# EAGLE design hand_pcb (EAGLE 7.5.0)
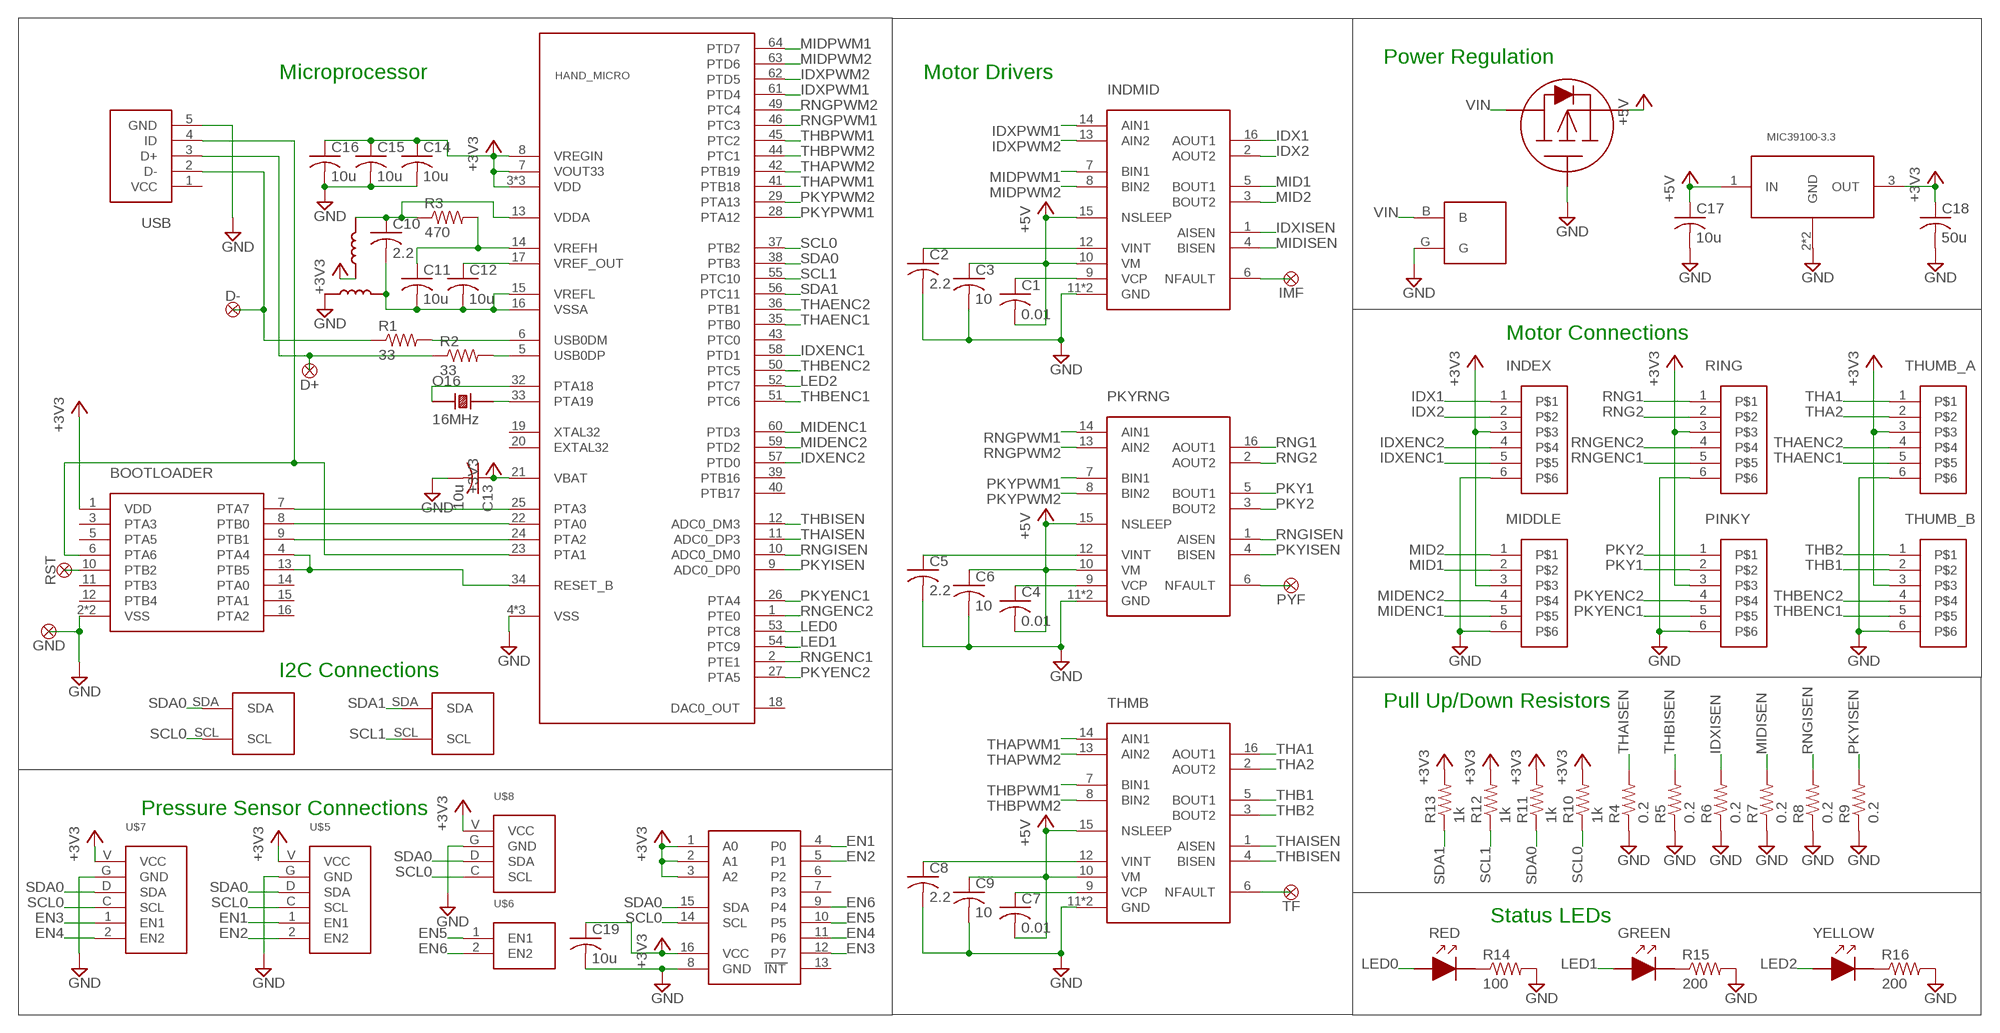
[diagram p0: schematic, sheet 1]

## Parts
BOOTLOADER  MKL02Z32CORRECT  [QFN16]
C1  0.01  C-USC0603  [C0603]
C2  2.2  C-USC0603  [C0603]
C3  10  C-USC0603  [C0603]
C4  0.01  C-USC0603  [C0603]
C5  2.2  C-USC0603  [C0603]
C6  10  C-USC0603  [C0603]
C7  0.01  C-USC0603  [C0603]
C8  2.2  C-USC0603  [C0603]
C9  10  C-USC0603  [C0603]
C10  2.2  C-USC0402  [C0402]
C11  10u  C-USC0402  [C0402]
C12  10u  C-USC0402  [C0402]
C13  10u  C-USC0402  [C0402]
C14  10u  C-USC0402  [C0402]
C15  10u  C-USC0402  [C0402]
C16  10u  C-USC0402  [C0402]
C17  10u  C-USC0603  [C0603]
C18  50u  C-USC0603  [C0603]
C19  10u  C-USC0402  [C0402]
D+  TESTPAD  [TESTPAD]
D-  TESTPAD  [TESTPAD]
GND  TESTPAD  [TESTPAD]
GREEN  LED0603  [L0603]
HAND_MICRO  MK20DX256VLH7  [LQFP-64-10-10]
IMF  TESTPAD  [TESTPAD]
INDEX  DF57H-6PTOP  [DF57H-6P-TOP]
INDMID  DRV8833  [WQFN-16]
MIDDLE  DF57H-6PTOP  [DF57H-6P-TOP]
O16  16MHz  NX3225SA  [NX3225SA]
PINKY  DF57H-6PTOP  [DF57H-6P-TOP]
PKYRNG  DRV8833  [WQFN-16]
PYF  TESTPAD  [TESTPAD]
R1  33  R-US_R0402  [R0402]
R2  33  R-US_R0402  [R0402]
R3  470  R-US_R0402  [R0402]
R4  0.2  R-US_R1206  [R1206]
R5  0.2  R-US_R1206  [R1206]
R6  0.2  R-US_R1206  [R1206]
R7  0.2  R-US_R1206  [R1206]
R8  0.2  R-US_R1206  [R1206]
R9  0.2  R-US_R1206  [R1206]
R10  1k  R-US_R0603  [R0603]
R11  1k  R-US_R0603  [R0603]
R12  1k  R-US_R0603  [R0603]
R13  1k  R-US_R0603  [R0603]
R14  100  R-US_R0603  [R0603]
R15  200  R-US_R0603  [R0603]
R16  200  R-US_R0603  [R0603]
RED  LED0603  [L0603]
RING  DF57H-6PTOP  [DF57H-6P-TOP]
RST  TESTPAD  [TESTPAD]
TF  TESTPAD  [TESTPAD]
THMB  DRV8833  [WQFN-16]
THUMB_A  DF57H-6PTOP  [DF57H-6P-TOP]
THUMB_B  DF57H-6PTOP  [DF57H-6P-TOP]
U$1  TCA9534TSSOP  [TSSOP16]
U$2  SPD15P10PLG  [PG-TO-252-3]
U$3  FERRITE600OHM100MHZ  [L0603]
U$4  FERRITE600OHM100MHZ  [L0603]
U$5  PSENSE  [PSENSE]
U$6  PSENSE2  [PSENSE2]
U$7  PSENSE  [PSENSE]
U$8  PSENSE4  [PSENSE4]
U$9  MIC391003.3  [MIC39100]
U$10  THRUHOLE2  [THRUHOLE2]
U$11  THRUHOLEI2C  [THRUHOLEI2C]
U$12  THRUHOLEI2C  [THRUHOLEI2C]
USB  10118194-0001LF  [10118194-0001LF]
YELLOW  LED0603  [L0603]

## Nets
+3V3: BOOTLOADER.1(VDD) C13.1 C14.1 C15.1 C16.1 C18.1 C19.1 HAND_MICRO.3(VDD) HAND_MICRO.7(VOUT33) HAND_MICRO.8(VREGIN) HAND_MICRO.21(VBAT) HAND_MICRO.30(VDD) HAND_MICRO.48(VDD) INDEX.3 MIDDLE.3 PINKY.3 R10.2 R11.2 R12.2 R13.2 RING.3 THUMB_A.3 THUMB_B.3 U$1.1(A0) U$1.2(A1) U$1.3(A2) U$1.16(VCC) U$4.1 U$5.V(VCC) U$7.V(VCC) U$8.V(VCC) U$9.3(OUT)
+5V: C1.2 C3.1 C4.2 C6.1 C7.2 C9.1 C17.1 INDMID.10(VM) INDMID.15(NSLEEP) PKYRNG.10(VM) PKYRNG.15(NSLEEP) THMB.10(VM) THMB.15(NSLEEP) U$2.3 U$9.1(IN)
EN1: U$1.4(P0) U$5.1(EN1)
EN2: U$1.5(P1) U$5.2(EN2)
EN3: U$1.12(P7) U$7.1(EN1)
EN4: U$1.11(P6) U$7.2(EN2)
EN5: U$1.10(P5) U$6.1(EN1)
EN6: U$1.9(P4) U$6.2(EN2)
GND: BOOTLOADER.2(VSS) BOOTLOADER.TH(VSS) C2.2 C3.2 C5.2 C6.2 C8.2 C9.2 C13.2 C14.2 C15.2 C16.2 C17.2 C18.2 C19.2 GND.P$1 HAND_MICRO.4(VSS) HAND_MICRO.31(VSS) HAND_MICRO.47(VSS) INDEX.6 INDMID.11(GND) INDMID.PPAD(GND) MIDDLE.6 PINKY.6 PKYRNG.11(GND) PKYRNG.PPAD(GND) R4.1 R5.1 R6.1 R7.1 R8.1 R9.1 R14.2 R15.2 R16.2 RING.6 THMB.11(GND) THMB.PPAD(GND) THUMB_A.6 THUMB_B.6 U$1.8(GND) U$2.1 U$3.1 U$5.G(GND) U$7.G(GND) U$8.G(GND) U$9.2(GND) U$9.TAB(GND) U$10.G USB.5(GND)
IDX1: INDEX.1 INDMID.16(AOUT1)
IDX2: INDEX.2 INDMID.2(AOUT2)
IDXENC1: HAND_MICRO.58(PTD1) INDEX.5
IDXENC2: HAND_MICRO.57(PTD0) INDEX.4
IDXISEN: INDMID.1(AISEN) R6.2
IDXPWM1: HAND_MICRO.61(PTD4) INDMID.14(AIN1)
IDXPWM2: HAND_MICRO.62(PTD5) INDMID.13(AIN2)
LED0: HAND_MICRO.53(PTC8) RED.1
LED1: GREEN.1 HAND_MICRO.54(PTC9)
LED2: HAND_MICRO.52(PTC7) YELLOW.1
MID1: INDMID.5(BOUT1) MIDDLE.2
MID2: INDMID.3(BOUT2) MIDDLE.1
MIDENC1: HAND_MICRO.60(PTD3) MIDDLE.5
MIDENC2: HAND_MICRO.59(PTD2) MIDDLE.4
MIDISEN: INDMID.4(BISEN) R7.2
MIDPWM1: HAND_MICRO.64(PTD7) INDMID.7(BIN1)
MIDPWM2: HAND_MICRO.63(PTD6) INDMID.8(BIN2)
N$1: R14.1 RED.2
N$2: GREEN.2 R15.1
N$3: R16.1 YELLOW.2
N$4: IMF.P$1 INDMID.6(NFAULT)
N$5: PKYRNG.6(NFAULT) PYF.P$1
N$6: TF.P$1 THMB.6(NFAULT)
N$7: C10.1 HAND_MICRO.13(VDDA) R3.1 U$4.2
N$8: BOOTLOADER.9(PTB1) HAND_MICRO.24(PTA2)
N$9: C11.1 HAND_MICRO.14(VREFH) R3.2
N$10: BOOTLOADER.8(PTB0) HAND_MICRO.22(PTA0)
N$11: BOOTLOADER.7(PTA7) HAND_MICRO.25(PTA3)
N$12: BOOTLOADER.10(PTB2) RST.P$1
N$17: BOOTLOADER.4(PTA4) BOOTLOADER.13(PTB5) HAND_MICRO.34(RESET_B)
N$18: C10.2 C11.2 C12.2 HAND_MICRO.15(VREFL) HAND_MICRO.16(VSSA) U$3.2
N$21: C1.1 INDMID.9(VCP)
N$22: C4.1 PKYRNG.9(VCP)
N$23: C7.1 THMB.9(VCP)
N$24: HAND_MICRO.33(PTA19) O16.3
N$25: C8.1 THMB.12(VINT)
N$26: C5.1 PKYRNG.12(VINT)
N$27: C2.1 INDMID.12(VINT)
N$28: HAND_MICRO.32(PTA18) O16.1
N$34: C12.1 HAND_MICRO.17(VREF_OUT)
N$35: BOOTLOADER.6(PTA6) HAND_MICRO.23(PTA1) USB.4(ID)
PKY1: PINKY.2 PKYRNG.5(BOUT1)
PKY2: PINKY.1 PKYRNG.3(BOUT2)
PKYENC1: HAND_MICRO.26(PTA4) PINKY.5
PKYENC2: HAND_MICRO.27(PTA5) PINKY.4
PKYISEN: HAND_MICRO.9(ADC0_DP0) PKYRNG.4(BISEN) R9.2
PKYPWM1: HAND_MICRO.28(PTA12) PKYRNG.7(BIN1)
PKYPWM2: HAND_MICRO.29(PTA13) PKYRNG.8(BIN2)
RNG1: PKYRNG.16(AOUT1) RING.1
RNG2: PKYRNG.2(AOUT2) RING.2
RNGENC1: HAND_MICRO.2(PTE1) RING.5
RNGENC2: HAND_MICRO.1(PTE0) RING.4
RNGISEN: HAND_MICRO.10(ADC0_DM0) PKYRNG.1(AISEN) R8.2
RNGPWM1: HAND_MICRO.46(PTC3) PKYRNG.14(AIN1)
RNGPWM2: HAND_MICRO.49(PTC4) PKYRNG.13(AIN2)
SCL0: HAND_MICRO.37(PTB2) R10.1 U$1.14(SCL) U$5.C(SCL) U$7.C(SCL) U$8.C(SCL) U$11.SCL
SCL1: HAND_MICRO.55(PTC10) R12.1 U$12.SCL
SDA0: HAND_MICRO.38(PTB3) R11.1 U$1.15(SDA) U$5.D(SDA) U$7.D(SDA) U$8.D(SDA) U$11.SDA
SDA1: HAND_MICRO.56(PTC11) R13.1 U$12.SDA
THA1: THMB.16(AOUT1) THUMB_A.1
THA2: THMB.2(AOUT2) THUMB_A.2
THAENC1: HAND_MICRO.35(PTB0) THUMB_A.5
THAENC2: HAND_MICRO.36(PTB1) THUMB_A.4
THAISEN: HAND_MICRO.11(ADC0_DP3) R4.2 THMB.1(AISEN)
THAPWM1: HAND_MICRO.41(PTB18) THMB.14(AIN1)
THAPWM2: HAND_MICRO.42(PTB19) THMB.13(AIN2)
THB1: THMB.5(BOUT1) THUMB_B.2
THB2: THMB.3(BOUT2) THUMB_B.1
THBENC1: HAND_MICRO.51(PTC6) THUMB_B.5
THBENC2: HAND_MICRO.50(PTC5) THUMB_B.4
THBISEN: HAND_MICRO.12(ADC0_DM3) R5.2 THMB.4(BISEN)
THBPWM1: HAND_MICRO.45(PTC2) THMB.7(BIN1)
THBPWM2: HAND_MICRO.44(PTC1) THMB.8(BIN2)
USB_D1_N [USB]: D-.P$1 R1.1 USB.2(D-)
USB_D1_P [USB]: D+.P$1 R2.1 USB.3(D+)
USB_D2_N [USB]: HAND_MICRO.6(USB0DM) R1.2
USB_D2_P [USB]: HAND_MICRO.5(USB0DP) R2.2
VIN: U$2.2 U$10.B
Unconnected: BOOTLOADER.3(PTA3) BOOTLOADER.5(PTA5) BOOTLOADER.11(PTB3) BOOTLOADER.12(PTB4) BOOTLOADER.14(PTA0) BOOTLOADER.15(PTA1) BOOTLOADER.16(PTA2) HAND_MICRO.18(DAC0_OUT) HAND_MICRO.19(XTAL32) HAND_MICRO.20(EXTAL32) HAND_MICRO.39(PTB16) HAND_MICRO.40(PTB17) HAND_MICRO.43(PTC0) U$1.6(P2) U$1.7(P3) U$1.13(INT) USB.1(VCC)

## Notes on the sheet
- Power Regulation
- Microprocessor | Motor Drivers
- Motor Connections
- I2C Connections
- Pull Up/Down Resistors
- Pressure Sensor Connections
- Status LEDs

## Library data of the parts
BOOTLOADER = 445-eagle-lib:MKL02Z32
C1-C19 = rcl:C-US: CAPACITOR, American symbol
D+ D- GND IMF PYF RST TF = 445-eagle-lib:TESTPAD
GREEN RED YELLOW = 445-eagle-lib:LED0603
HAND_MICRO = 445-eagle-lib:MK20DX256VLH7
INDEX MIDDLE PINKY RING THUMB_A THUMB_B = 445-eagle-lib:DF57H-6P
INDMID PKYRNG THMB = 445-eagle-lib:DRV8833
O16 = 445-eagle-lib:NX3225SA
R1-R16 = rcl:R-US_: RESISTOR, American symbol
U$1 = 445-eagle-lib:TCA9534: 8 Bit IO Expander
U$2 = 445-eagle-lib:SPD15P10PLG
U$3 U$4 = 445-eagle-lib:FERRITE600OHM100MHZ
U$5 U$7 = 445-eagle-lib:PSENSE
U$6 = 445-eagle-lib:PSENSE2
U$8 = 445-eagle-lib:PSENSE4
U$9 = 445-eagle-lib:MIC391003.3
U$10 = 445-eagle-lib:THRUHOLE2
U$11 U$12 = 445-eagle-lib:THRUHOLEI2C
USB = 445-eagle-lib:10118194-0001LF

## Net classes
1 USB: width 0.333 mm, drill 0.333 mm, clearance 0.178 mm
2 VCC_Pour: clearance 0.762 mm to class 1
3 GND_Pour: clearance 0.762 mm to class 1

## Board
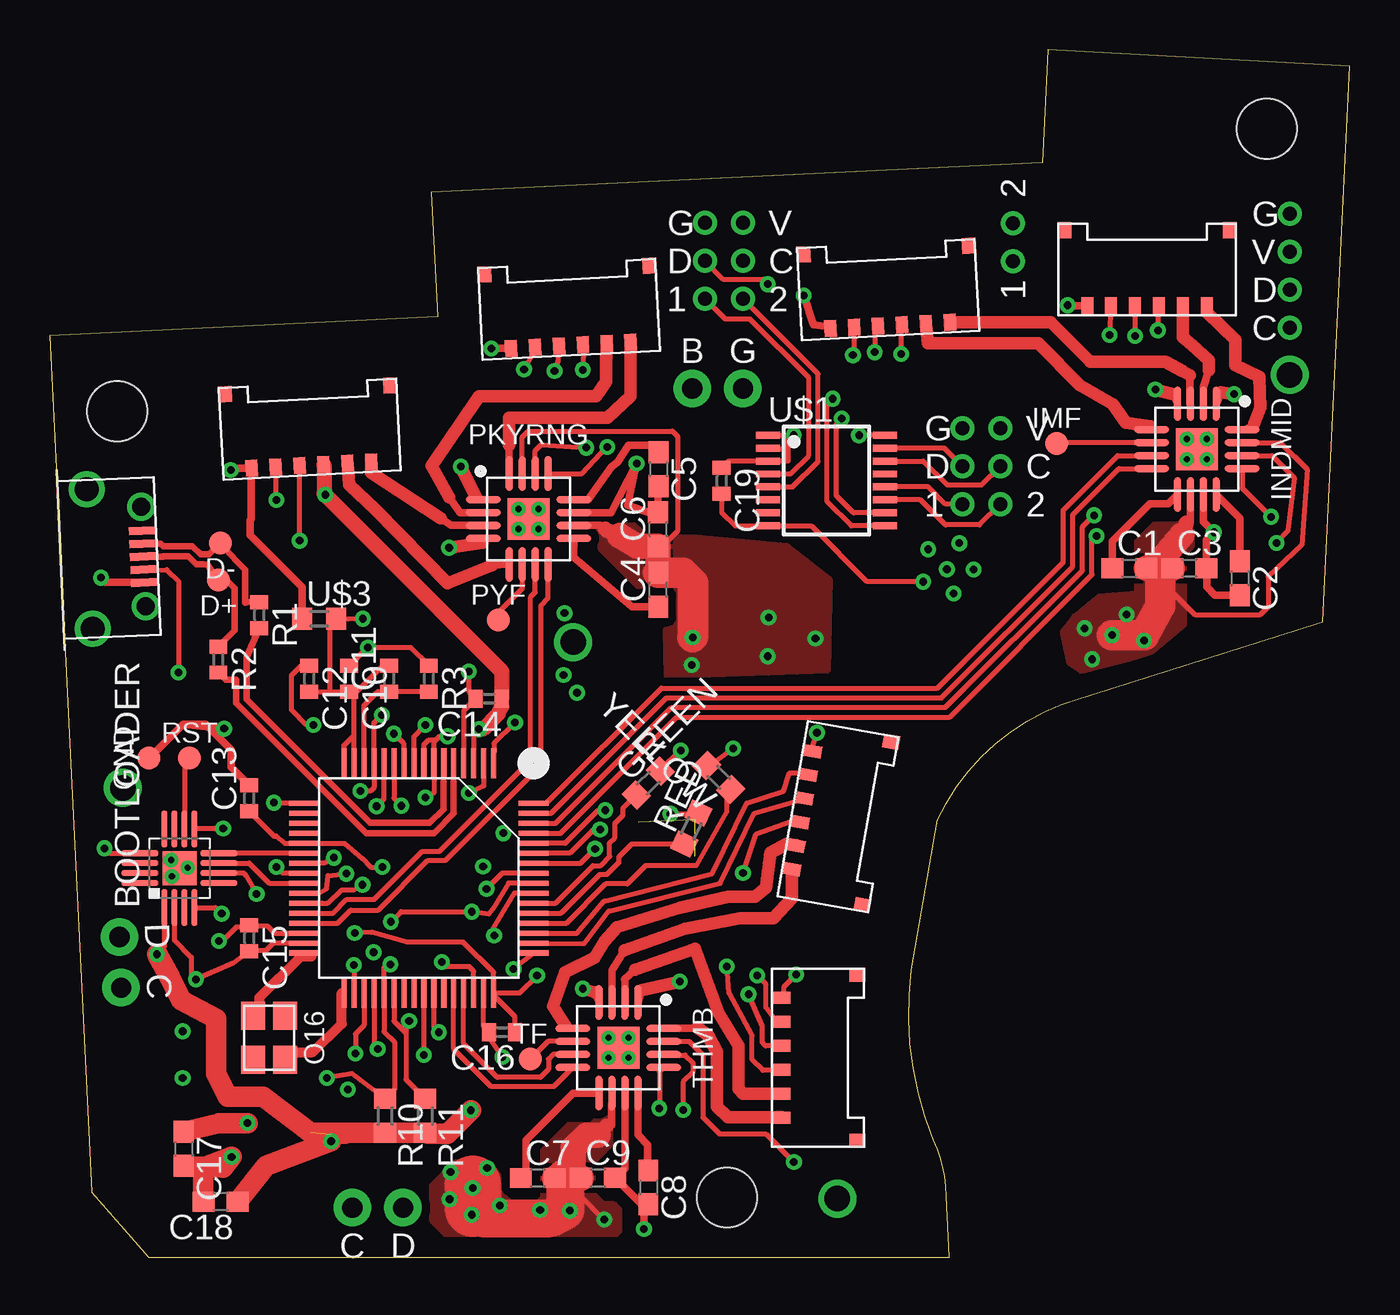
[diagram p1: board, top side]
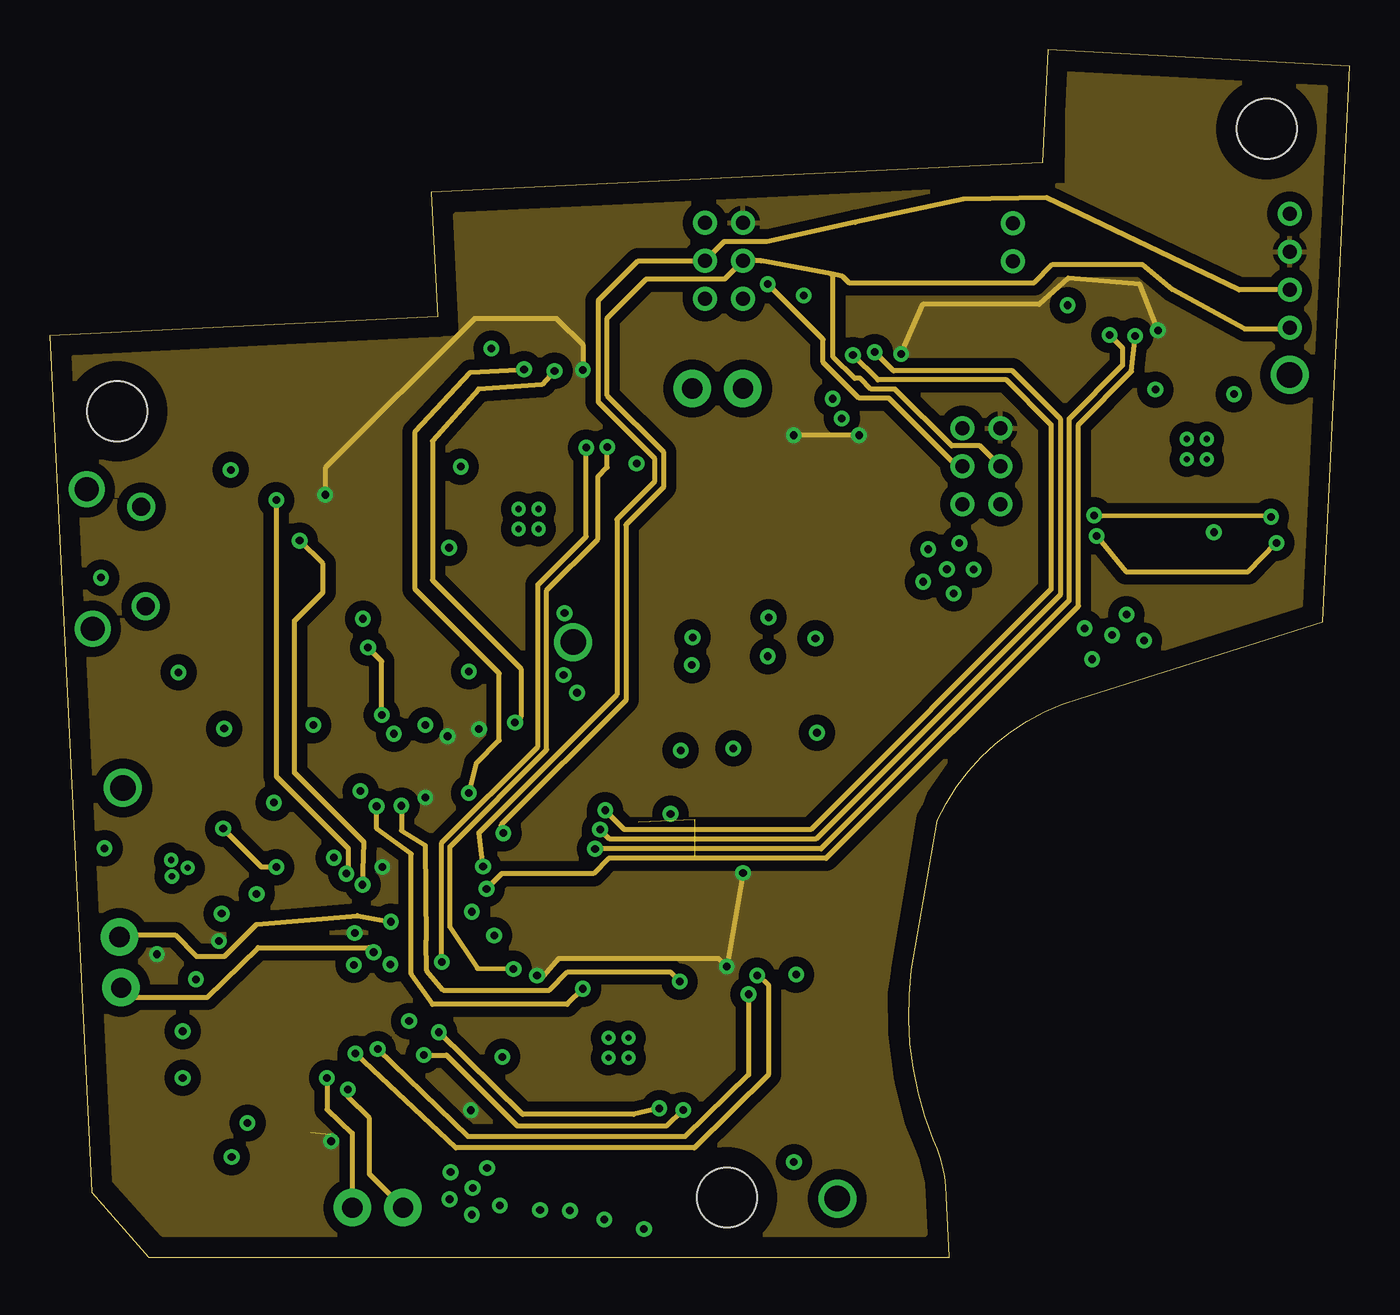
[diagram p2: board, inner layer Route2]
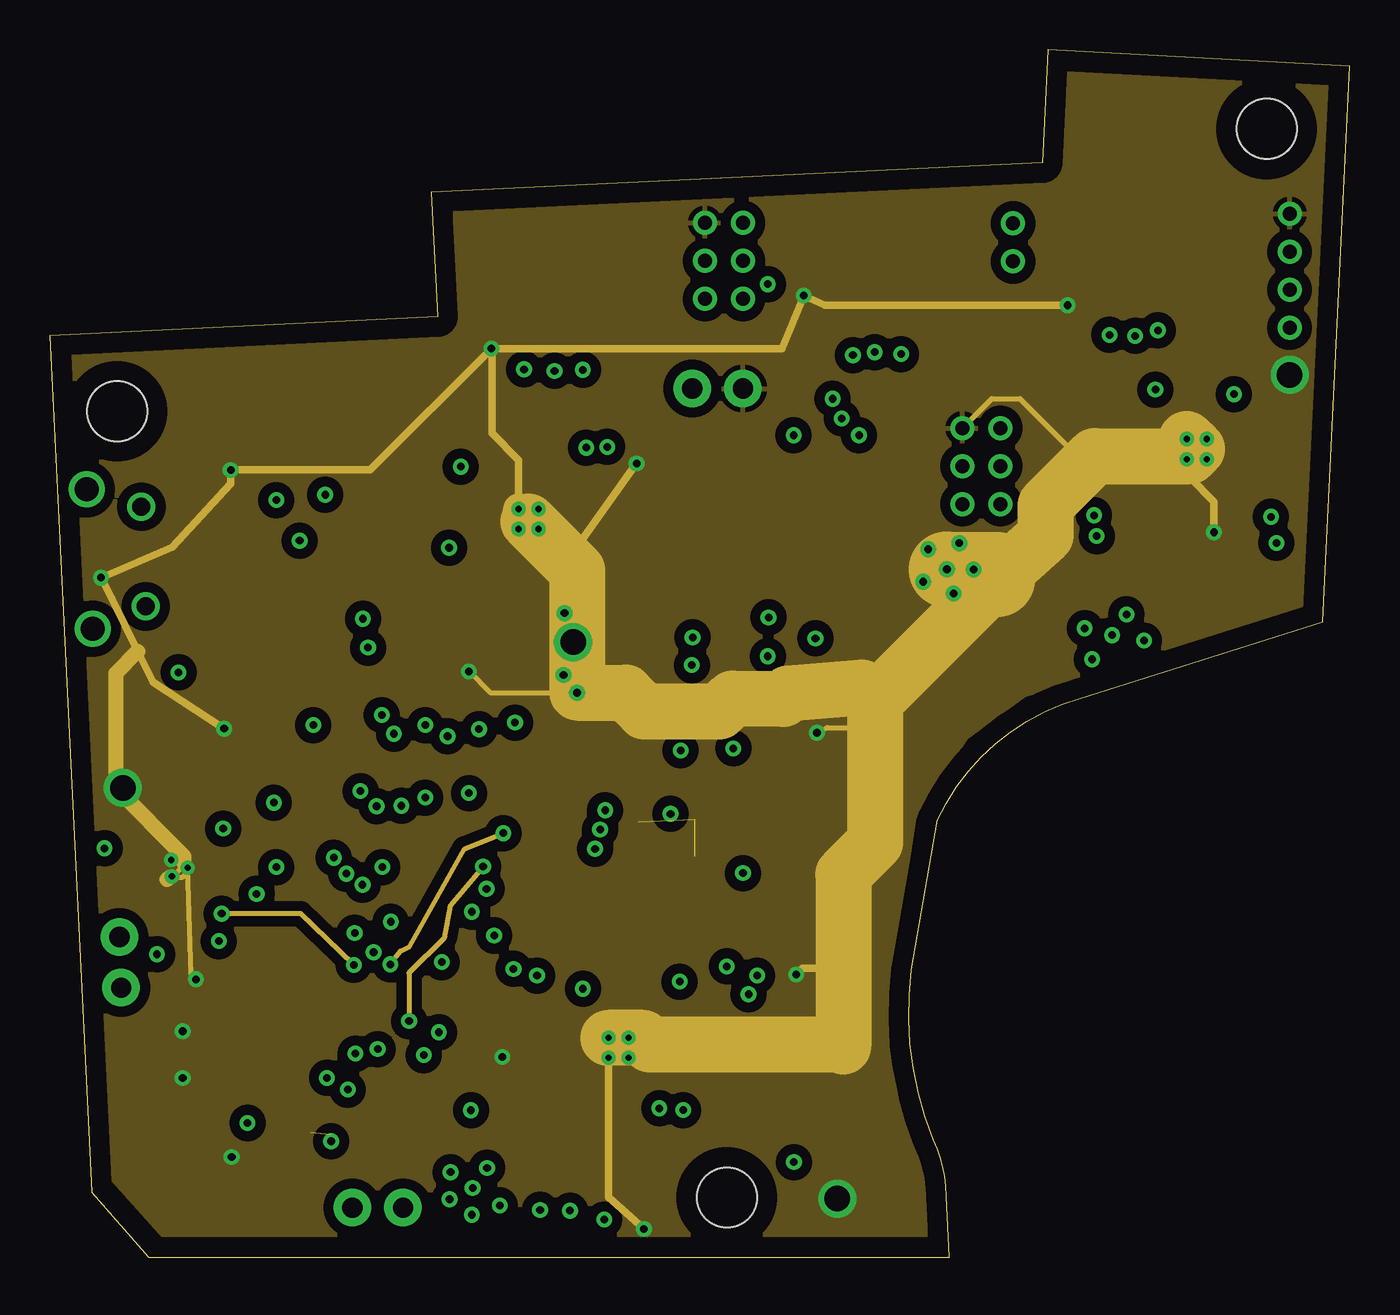
[diagram p3: board, inner layer Route15]
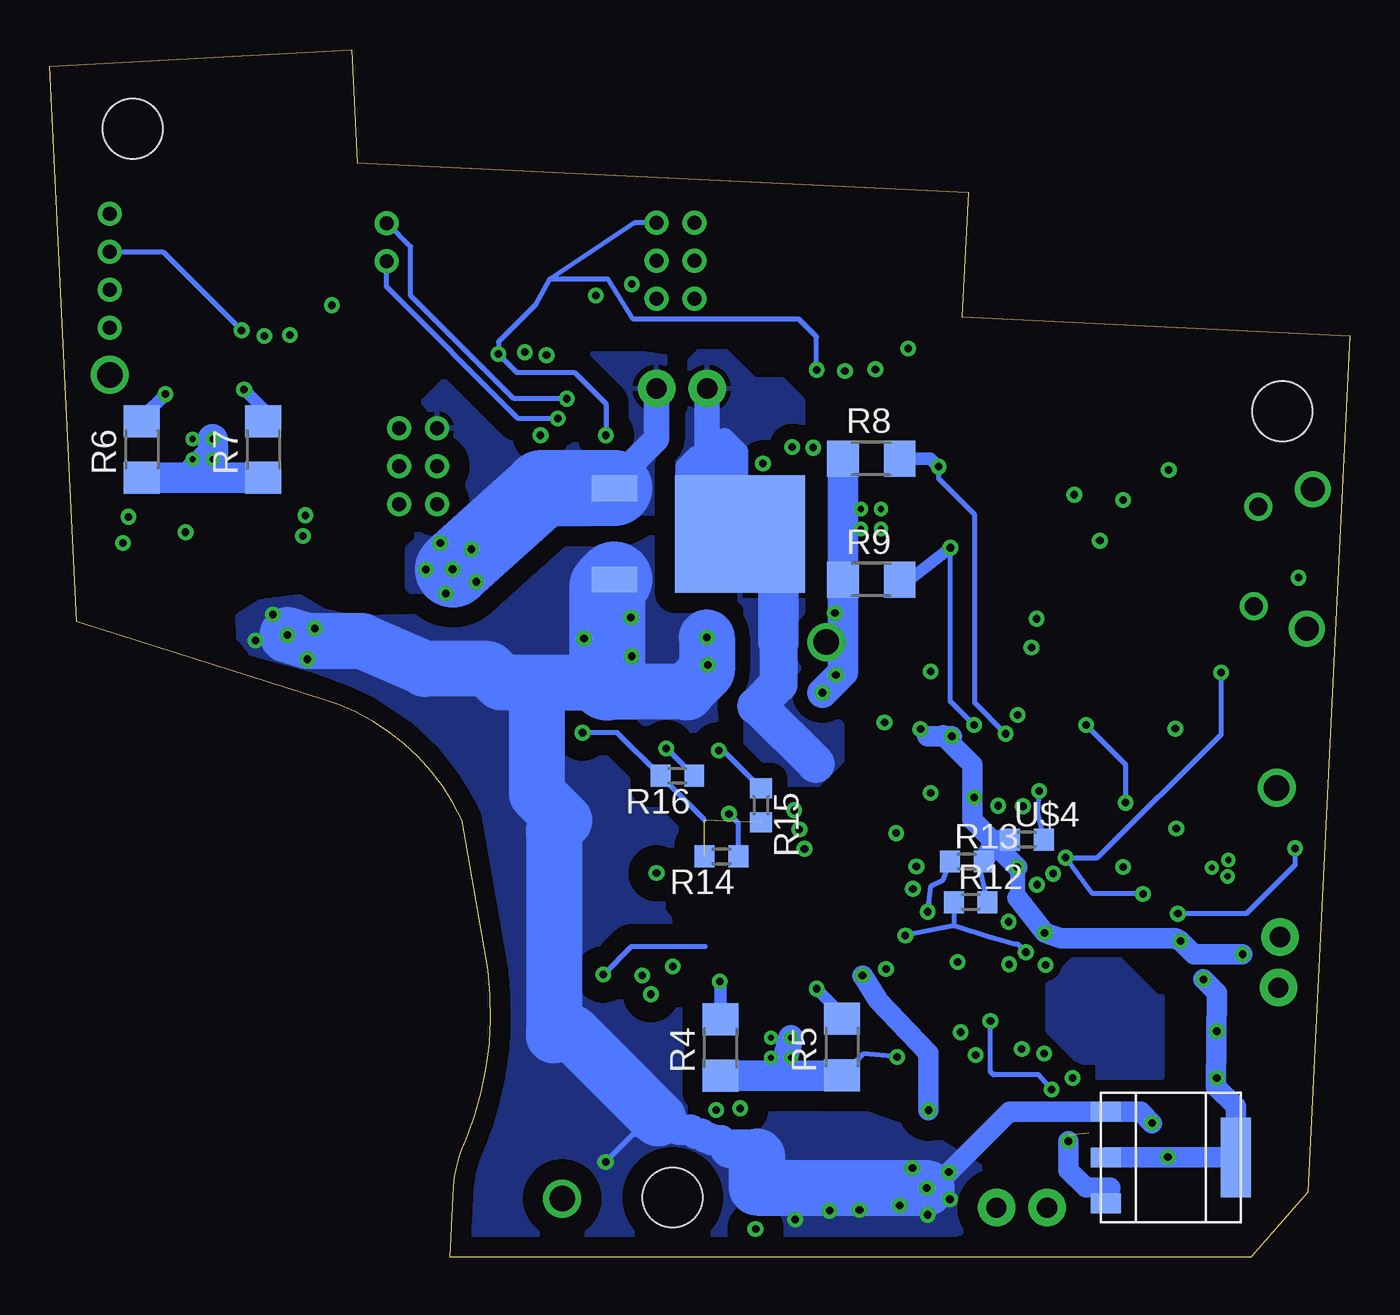
[diagram p4: board, bottom side, seen from below]

Size 65.16 x 60.51 mm. Coordinates in mm from the lower left corner, seen from the top.
Outline: 4.95,0 45.09,0 44.94,3.07 arc25 44.3,5.9 arc-30 43.2,14.4 44.5,21.9 arc-50 51.67,28.01 63.82,31.84 65.16,59.68 50.03,60.51 49.76,54.86 19.12,53.37 19.43,47.13 0,46.18 2.09,3.25 4.95,0
Copper layers (1*2*15*16): Top 0.035mm / dielectric 0.2mm / Route2 0.035mm / dielectric 0.2mm / Route15 0.035mm / dielectric 0.2mm / Bottom 0.035mm
Design rules "default *": minimum track width 10mil, minimum drill 15mil, track to track 6mil, track to pad 6mil, pad to pad 6mil, via to via 6mil, smd to smd 6mil, copper to edge 40mil, drill to drill 8mil, minimum pad ring 10mil, minimum via ring 8mil, stop-mask expansion 4mil, vias tented up to drill 0mil, thermal gap 10mil
Holes 3 mm at 3.37,42.4 61,56.55 33.94,3
tKeepout: area 1.3,40.3 to 5.5,44.5; area 58.9,54.4 to 63.1,58.6; area 31.8,0.9 to 36,5.1

### Footprints (pad centres in the part's own frame; a part is rotated, then mirrored left to right if it is on the bottom)
QFN16 = smd 1.85 x 0.3: 1 -1.975,0.75; 2 -1.975,0.25; 3 -1.975,-0.25; 4 -1.975,-0.75; 9 1.975,-0.75; 10 1.975,-0.25; 11 1.975,0.25; 12 1.975,0.75 | smd 0.3 x 1.85: 5 -0.75,-1.975; 6 -0.25,-1.975; 7 0.25,-1.975; 8 0.75,-1.975; 13 0.75,1.975; 14 0.25,1.975; 15 -0.25,1.975; 16 -0.75,1.975 | smd 1.7 x 1.7: TH 0,0
C0603 = smd 1.1 x 1: 1 -0.85,0; 2 0.85,0
C0402 = smd 0.7 x 0.9: 1 -0.65,0; 2 0.65,0
TESTPAD = smd 1.143 x 1.143: P$1 0,0
L0603 = smd 1 x 1.1: 1 -0.85,0; 2 0.85,0
LQFP-64-10-10 = smd 1.5 x 0.254: 1 -5.75,3.75; 2 -5.75,3.25; 3 -5.75,2.75; 4 -5.75,2.25; 5 -5.75,1.75; 6 -5.75,1.25; 7 -5.75,0.75; 8 -5.75,0.25; 9 -5.75,-0.25; 10 -5.75,-0.75; 11 -5.75,-1.25; 12 -5.75,-1.75; 13 -5.75,-2.25; 14 -5.75,-2.75; 15 -5.75,-3.25; 16 -5.75,-3.75; 33 5.75,-3.75; 34 5.75,-3.25; 35 5.75,-2.75; 36 5.75,-2.25; 37 5.75,-1.75; 38 5.75,-1.25; 39 5.75,-0.75; 40 5.75,-0.25; 41 5.75,0.25; 42 5.75,0.75; 43 5.75,1.25; 44 5.75,1.75; 45 5.75,2.25; 46 5.75,2.75; 47 5.75,3.25; 48 5.75,3.75 | smd 0.254 x 1.5: 17 -3.75,-5.75; 18 -3.25,-5.75; 19 -2.75,-5.75; 20 -2.25,-5.75; 21 -1.75,-5.75; 22 -1.25,-5.75; 23 -0.75,-5.75; 24 -0.25,-5.75; 25 0.25,-5.75; 26 0.75,-5.75; 27 1.25,-5.75; 28 1.75,-5.75; 29 2.25,-5.75; 30 2.75,-5.75; 31 3.25,-5.75; 32 3.75,-5.75; 49 3.75,5.75; 50 3.25,5.75; 51 2.75,5.75; 52 2.25,5.75; 53 1.75,5.75; 54 1.25,5.75; 55 0.75,5.75; 56 0.25,5.75; 57 -0.25,5.75; 58 -0.75,5.75; 59 -1.25,5.75; 60 -1.75,5.75; 61 -2.25,5.75; 62 -2.75,5.75; 63 -3.25,5.75; 64 -3.75,5.75
DF57H-6P-TOP = smd 0.6 x 0.85: 1 -3,2.3; 2 -1.8,2.3; 3 -0.6,2.3; 4 0.6,2.3; 5 1.8,2.3; 6 3,2.3 | smd 0.7 x 0.8: P$1 -4.15,-1.475; P$2 4.15,-1.475
WQFN-16 = smd 1.75 x 0.35: 1 -2.275,0.975; 2 -2.275,0.325; 3 -2.275,-0.325; 4 -2.275,-0.975; 9 2.275,-0.975; 10 2.275,-0.325; 11 2.275,0.325; 12 2.275,0.975 | smd 0.35 x 1.75: 5 -0.975,-2.275; 6 -0.325,-2.275; 7 0.325,-2.275; 8 0.975,-2.275; 13 0.975,2.275; 14 0.325,2.275; 15 -0.325,2.275; 16 -0.975,2.275 | smd 2.1 x 2.1: PPAD 0,0
NX3225SA = smd 1.4 x 1.2: 1 -1.1,-0.8; 2 1.1,-0.8; 3 1.1,0.8; 4 -1.1,0.8
R0402 = smd 0.7 x 0.9: 1 -0.65,0; 2 0.65,0
R1206 = smd 1.6 x 1.803: 1 -1.422,0; 2 1.422,0
R0603 = smd 1 x 1.1: 1 -0.85,0; 2 0.85,0
TSSOP16 = smd 0.35 x 1.2: 1 -2.275,-2.925; 2 -1.625,-2.925; 3 -0.975,-2.925; 4 -0.325,-2.925; 5 0.325,-2.925; 6 0.975,-2.925; 7 1.625,-2.925; 8 2.275,-2.925; 9 2.275,2.925; 10 1.625,2.925; 11 0.975,2.925; 12 0.325,2.925; 13 -0.325,2.925; 14 -0.975,2.925; 15 -1.625,2.925; 16 -2.275,2.925
PG-TO-252-3 = smd 1.295 x 2.311: 1 -2.286,-4.191; 3 2.286,-4.191 | smd 5.893 x 6.502: 2 0,2.095
PSENSE = drill 0.7: 1 0,-3.81; 2 1.905,-3.81; C 1.905,-1.905; D 0,-1.905; G 0,0; V 1.905,0
PSENSE2 = drill 0.7: 1 0,0; 2 1.905,0
PSENSE4 = drill 0.7: C 0,-5.715; D 0,-3.81; G 0,0; V 0,-1.905
MIC39100 = smd 1 x 1.5: 1 -2.3,-3.25; 2 0,-3.25; 3 2.3,-3.25 | smd 4 x 1.5: TAB 0,3.25
THRUHOLE2 = drill 1.016 pad 1.88: B -1.27,0; G 1.27,0
THRUHOLEI2C = drill 1.016 pad 1.88: SCL 1.27,0; SDA -1.27,0
10118194-0001LF = smd 0.4 x 1.35: 1 -1.3,2.7; 2 -0.65,2.7; 3 0,2.7; 4 0.65,2.7; 5 1.3,2.7 | drill 0.9 pad 1.4: P$6 -2.5,2.7; P$7 2.5,2.7 | drill 1.2: P$8 -3.5,0; P$9 3.5,0

### Placement (x,y rotation side)
BOOTLOADER  6.5,19.5 90 top
C1  54.11,34.53 0 top
C2  59.65,34.03 270 top
C3  57.13,34.54 0 top
C4  30.5,33.46 90 top
C5  30.5,39.5 270 top
C6  30.5,36.49 90 top
C7  24.46,3.97 0 top
C8  30,3.5 270 top
C9  27.48,3.98 0 top
C10  15,29 270 top
C11  17,29 90 top
C12  13,29 270 top
C13  10,23 90 top
C14  22,28 180 top
C15  10,16 270 top
C16  22.67,11.29 180 top
C17  6.71,5.44 270 top
C18  8.56,2.79 180 top
C19  33.68,38.91 270 top
D+  8.45,33.93 180 top
D-  8.54,35.8 180 top
GND  4.98,25.02 90 top
GREEN  30,23.77 45 top
HAND_MICRO  18.5,19 270 top
IMF  50.47,40.79 0 top
INDEX  55,50 180 top
INDMID  57.5,40.5 270 top
MIDDLE  42,49 183 top
O16  11,11 270 top
PINKY  13,42 183 top
PKYRNG  24,37 0 top
PYF  22.48,31.93 0 top
R1  10.5,32.19 270 top
R2  8.45,29.96 270 top
R3  19,29 270 top
R4  31.55,10.52 90 bottom
R5  25.45,10.54 90 bottom
R6  60.55,40.49 90 bottom
R7  54.46,40.49 90 bottom
R8  23.98,40.03 0 bottom
R9  23.98,33.96 0 bottom
R10  16.8,7.09 270 top
R11  18.82,7.09 270 top
R12  19,17.81 0 bottom
R13  19.19,19.84 0 bottom
R14  31.5,20.09 180 bottom
R15  29.51,22.66 270 bottom
R16  33.71,24.13 180 bottom
RED  32.16,21.49 65 top
RING  26,48 183 top
RST  7,25.02 0 top
TF  24.08,9.93 0 top
THMB  28.5,10.5 270 top
THUMB_A  39,10 90 top
THUMB_B  40,22 80 top
U$1  38.93,38.93 270 top
U$2  32.66,36.26 270 bottom
U$3  13.5,32 0 top
U$4  16.18,20.94 0 bottom
U$5  32.84,51.84 0 top
U$6  48.29,49.91 90 top
U$7  45.75,41.55 0 top
U$8  62.15,52.3 0 top
U$9  8.97,5 270 bottom
U$10  33.48,43.54 0 top
U$11  16.43,2.49 180 top
U$12  3.53,14.78 272 top
USB  2,35 272.5 top
YELLOW  33.53,24.05 135 top

### Tracks (layer width: path | path; a pad name or v marks a point on that pad's centre or on a via)
+3V3  (via drill 0.38, 0.39)  (1 unrouted)
  Top 0.254: THUMB_A.3 36.67,9.37 35.74,9.37 35.2,9.91 35.2,11.12 34.04,13.26 v33.93,14.58 | THUMB_B.3 37.49,21.95 35.41,21.21 v34.75,19.25 | C13.1 11.24,21.11 11.35,21.11 11.79,20.75 HAND_MICRO.21 14.79,20.75 15.65,19.99 16.08,19.56 v16.66,19.56 | HAND_MICRO.3 21.25,26.2 v21.51,26.47 | v18.82,23.04 19.25,23.27 HAND_MICRO.7 19.25,25.83 19.36,25.93 | PINKY.3 13.74,39.71 | 13.74,38.28 v13.8,38.21 | RING.3 26.75,45.71 v26.72,44.48 | C14.1 22.65,27.6 | 19.36,25.93 19.53,26.11 v19.94,26.11 | MIDDLE.3 42.67,46.69 v42.67,45.26 | INDEX.3 55.55,47.65 v55.55,46.46 | HAND_MICRO.8 18.75,25.65 18.76,25.7 18.99,25.93 19.36,25.93 | HAND_MICRO.48 22.25,14.28 20.73,15.8 17.91,15.8 16.13,16.28 15.25,16.24 v15.28,16.27 v15.28,16.26 | HAND_MICRO.48 22.25,13.13 23.3,12.08 23.3,11.31 C16.1 | v8.47,15.85 8.64,15.85 9.34,16.55 9.9,16.55 C15.1 10.04,16.61 10.9,16.61 11.26,16.25 HAND_MICRO.30 | HAND_MICRO.48 23.55,13.25 v24.42,14.12 | U$1.1 37.01,41.21 37.01,41.2 | 37.01,41.2 37.01,40.51 | 37.01,40.51 37.01,39.91 U$1.3 34.02,39.91 C19.1 | U$1.2 36.01,40.51 37.01,40.51 | U$1.16 40.66,41.21 v40.56,41.2 | v37.29,41.2 37.01,41.2 | v5.37,15.19 5.75,15.57 BOOTLOADER.1
  Top 0.762: 13.74,39.71 13.74,38.28 | v13.8,38.21 22.65,29.37 C14.1 | 22.65,27.6 22.48,27.23 21.72,26.47 v21.51,26.47
  Top 1.016: v5.37,15.19 6.02,14.01 6.58,12.88 8.33,11.96 8.33,9.2 8.91,8.05 10.69,8.05 13.07,6.24 R10.2 R11.2 | 18.97,6.2 19.94,6.2 v21.11,7.37 | C18.1 10.83,4.59 v14.1,5.82 14.07,6.15 14.81,6.2
  Route2 0.254: v34.75,19.25 v33.93,14.58 33.53,14.99 25.51,14.99 24.78,14.12 v24.42,14.12 | v13.8,38.21 13.8,39.56 21.29,47.04 25.41,47.04 RING.3 v26.72,44.48 | v42.67,45.26 43.76,47.75 49.61,47.75 51.05,49.07 54.63,48.77 v55.55,46.46 | v40.56,41.2 v37.29,41.2
  Bottom 0.254: 17.44,21.08 U$4.1 17.36,20.45 17.36,20.25 | 21.16,26.11 v21.51,26.47 | R13.2 18.63,19.82 R12.2 | v26.72,44.48 26.72,46.13 27.61,47.02 35.92,47.02 37.19,49.02 40.11,49.02 | 40.11,49.02 40.82,47.73 42.67,45.87 v42.67,45.26 41.76,44.35 38.86,44.35 37.29,42.77 v37.29,41.2 | U$5.V 35.84,51.84 40.11,49.02 | U$8.V 59.49,50.39 v55.55,46.46
  Bottom 0.762: v16.66,19.56 16.66,18.01
  Bottom 1.016: U$4.1 17.91,20.9 18.92,21.92 18.92,24.69 20.4,26.16 | v19.94,26.11 21.16,26.11 | v16.66,19.56 17.36,20.25 | v5.37,15.19 7.81,15.19 v8.47,15.85 8.75,16 14.5,16 v15.28,16.26 16.66,18.01 | R13.2 18.04,20.45 17.36,20.45 | U$9.3 12,3.49 13.23,3.5 14.1,4.37 v14.1,5.82 | v24.42,14.12 24.41,14.11 23.62,12.85 21.11,10.24 v21.11,7.37
  pour Route2 (isolate 0.508): 20.32,52.25 20.62,46.08 1.19,45.09 3.23,3.84 5.64,1.17 43.89,1.17 43.76,3.71 43.48,4.83 43.15,5.64 42.8,6.53 42.21,8.79 41.91,11.15 41.88,13.31 41.99,13.89 42.14,14.99 42.8,18.8 43.33,22.17 43.64,22.71 43.87,23.34 45.11,25.15 46.13,26.24 47.37,27.23 48.82,28.14 50.7,28.98 53.8,29.87 56.97,30.84 62.71,32.69 63.96,58.62 51.03,59.31 50.98,53.72 25.63,52.5
+5V  (via drill 0.38, 0.39)
  Top 0.254: THMB.15 32.05,10.82 32.74,10.13 32.74,7.01 33.57,6.18 35.89,6.18 v37.3,4.78 | PKYRNG.15 23.68,41.1 23.98,41.4 31.2,41.4 31.47,41.13 31.47,36.4 30.71,35.64 C6.1 30.71,35.85 | 26.24,3.98 C9.1 26.63,3.05 v27.79,1.89 | 27.9,6.58 28.17,6.61 | INDMID.15 61.69,40.83 63.03,39.48 62.75,35.69 61.07,34.11 61.07,32.6 60.66,32.18 57.43,32.18 55.68,33.93
  Top 0.381: 28.17,6.61 28.17,7.26 THMB.10 | PKYRNG.10 27.57,36.67 27.84,36.49 | C6.1 | INDMID.10 57.17,36.83 56.97,36.8 | 55.72,34.75 55.5,34.54
  Top 0.762: 27.48,6.12 27.9,6.58 | 27.84,36.49 28.55,36.17 | 56.97,36.8 56.76,36.2
  Top 1.016: v9.91,6.73 8.5,6.73 C17.1
  Top 1.27: C4.2 C6.1 | C1.2 55.5,34.54 C3.1 | C9.1 25.84,3.98 C7.2 | 26.24,3.98 26.24,5.46 26.9,6.12 27.48,6.12 | 28.55,36.17 29.43,35.64 C6.1 | 56.76,36.2 55.88,35.17 55.72,34.75
  Top 1.524: C4.2 31.74,34.31 32.24,33.81 32.24,31.09 v32.22,31.06 | v53.25,31.18 54.88,31.18 55.68,32.66 55.68,33.93 55.68,34.36 55.5,34.54
  Top 1.905: 21.21,2.43 21.65,1.97 25.09,1.97 25.84,2.35 25.84,3.98
  Top 2.794: v21.2,3.48 21.21,3.71 21.21,2.43
  Bottom 0.254: v37.3,4.78 37.3,4.8 35.93,6.17 32.07,6.17 v27.79,1.89
  Bottom 1.016: v20.09,4.27 17.05,7.3 U$9.1 10.48,7.3 v9.91,6.73
  Bottom 1.524: 31.09,5.44 31.51,5.86 31.97,5.86 32.11,5.99 32.31,5.99 32.5,6.18 32.8,6.18 33.02,6.4 33.66,6.4 34.2,6.95 34.67,6.95
  Bottom 1.905: 29.7,5.05 30.09,5.44 31.09,5.44
  Bottom 2.794: v32.22,31.06 32.22,29.39 33.26,28.35 | 33.26,28.35 36.77,28.35 37.22,28.8 40.74,28.8 | 40.74,28.8 42.52,28.8 43.2,29.49 46.35,29.49 49.53,30.89 52.27,30.89 v53.25,31.18 | 33.26,28.35 33.22,28.31 | 39.89,21.37 39.89,11.28 | 39.89,11.28 39.89,11.12 | v21.2,3.48 29.72,3.49 29.7,3.5 29.7,5.05 | 34.67,6.95 39,11.28 39.89,11.28 | 39.38,21.88 40.74,23.24 40.74,28.8
  Bottom 3.81: U$2.3 37.22,33.6 37.22,28.8
  other vias: 38.38,31.01 36.03,32.07 53.98,32.22 35.99,30.12 32.18,29.68 51.88,31.52 52.25,29.97 54.85,30.91 22.56,2.6 21.92,4.48 20.04,2.91 21.16,2.13 24.57,2.37 26.07,2.34
  pour Top (isolate 0.406): 27.34,36.72 29.27,36.72 29.88,36.11 32.42,36.11 36.96,35.67 39.1,34 39,29.38 30.92,29.1 30.86,31.46 31.39,31.62 31.39,33.4 31.19,33.6 29.49,33.6 27.61,35.48 27.61,36.4 27.32,36.69
  pour Top (isolate 0.406): 57.25,37.29 57.25,35.61 56.88,35.24 56.88,31.69 55.16,30.23 51.71,29.34 51.12,29.76 50.75,31.34 51.36,32.13 52.62,33.16 54.48,33.3 54.48,35.86 55.38,36.77 56.63,36.77 57.15,37.29
  pour Top (isolate 0.406): 28.21,7.02 28.21,5.74 27.23,4.76 27.23,3.17 27.7,2.71 28.26,2.71 28.56,2.4 28.56,1.3 28,0.74 20.24,0.74 19.14,1.84 19.14,3.59 20.33,4.79 21.84,4.79 22.5,4.13 22.5,3.33 23.25,2.58 24.24,2.58 24.71,3.05 24.71,5.37 26.02,6.68 27.17,6.68 27.48,7 28.16,7 28.17,7.01
  pour Bottom (isolate 1.016, rank 2): 36.55,35.5 40.06,35.5 41.24,34.34 43.48,32.23 47.19,32.04 49.95,31.99 51.47,32.36 52.65,33.05 54.58,32.79 55.68,32.13 55.64,31.06 55.04,30.33 53.77,29.97 51.97,29.49 50.2,28.85 48.74,28.17 46.9,26.94 45.53,25.64 44.42,24.19 43.55,22.73 43.33,22.05 42.25,15.89 41.91,13.79 41.87,11.21 42.02,9.99 42.16,8.76 42.74,6.58 43.26,5.3 43.6,4.28 43.74,3.3 43.89,1.14 19.89,1.18 18.17,1.68 18.21,4.29 20.9,5.97 24.5,7.24 24.04,14.15 32.46,14.94 34.52,17.44 32.23,22.63 28.83,27.14 25.45,31.78 19.67,32.32 18.62,43.92 33.39,42.04
EN1
  Top 0.254: U$1.4 37.12,39.26 38.05,40.18 38.05,44.07 35.1,47.02 33.86,47.02 U$5.1
EN2
  Top 0.254: U$1.5 37.23,38.61 38.51,39.88 38.51,44.27 U$5.2
EN3
  Top 0.254: U$7.1 44.91,37.74 44.05,38.61 U$1.12
EN4
  Top 0.254: U$7.2 46.61,36.7 44.91,36.7 43.65,37.96 U$1.11
EN5  (via drill 0.38)
  Top 0.254: U$1.10 40.29,37.31 39.42,38.18 39.42,41.76 v39.7,42.04
  Bottom 0.254: v39.7,42.04 41.68,42.04 48.28,48.64 U$6.1
EN6  (via drill 0.38)
  Top 0.254: U$1.9 40.18,36.66 38.96,37.87 38.96,42.75 v39.24,43.03
  Bottom 0.254: v39.24,43.03 41.91,43.03 47.07,48.18 47.07,50.65 48.23,51.82 U$6.2
GND  (via drill 0.3, 0.38, 0.39, 1.27)  (2 unrouted)
  Top 0.254: THUMB_A.6 36.8,13.11 36.8,13.56 v37.41,14.17 | v38.46,26.29 38.18,25.48 THUMB_B.6 | C15.2 10.04,15.39 | PKYRNG.11 26.29,37.34 26.82,37.31 | PKYRNG.PPAD 24.35,37 24.69,37.34 23.56,37.34 v23.5,37.5 | HAND_MICRO.4 20.75,27.4 C14.2 21.01,28.34 v21.01,29.36 | HAND_MICRO.47 21.75,11.56 C16.2 22.02,11.01 v22.68,10.05 | INDMID.PPAD 57.5,40.52 v57,41.01 | HAND_MICRO.31 11.2,15.75 10.81,15.35 C15.2 | C15.2 | C15.2 9.18,14.74 v7.33,13.93 7.09,14.17 7.09,15.05 6.25,15.89 BOOTLOADER.2 | v43.78,33.86 43.75,33.88 40.95,33.88 38.17,36.66 U$1.8 34.36,36.66 33.68,37.34 C19.2 | v6.91,19.52 6.57,19.57 BOOTLOADER.TH
  Top 0.381: C3.2 57.83,34.69 | C2.2 58.41,33.18 57.99,33.6 57.99,34.53 C3.2 | PKYRNG.11 28.14,37.33 v29.41,39.79 28.97,37.68 30.07,37.31 C6.2 C5.2 | THMB.PPAD 28.5,10.6 v28,11 | v29.78,1.42 29.78,2.43 C8.2 29.66,2.65 C9.2 28.82,4.48 THMB.11 | INDMID.11 57.83,36.87 v58.36,36.34 57.98,35.95 C3.2 | INDEX.6 51.04,47.7 v51.03,47.71 | v37.8,48.2 38.28,46.74 39.02,46.65 MIDDLE.6 | RING.6 v22.14,45.55 v22.14,45.54 | v9.07,39.46 9.15,39.55 PINKY.6 10.08,39.51 10.08,36.98 10.05,36.94 10.05,36.18 12.65,33.58 U$3.1 | v2.56,34.06 2.81,33.82 USB.5 | C13.2 9.09,24.56 9.09,25.44 7.81,26.72 6.68,26.72 | 6.68,26.72 v8.74,26.49 | GND.P$1 6.68,26.72 | 5.91,19.5 v6.08,19.91
  Top 1.016: C17.2 8.7,4.48 v9.12,5.03 7.66,4.48 C18.2
  Route15 0.254: v38.46,26.29 38.96,26.54 41.38,26.54 | v23.5,36.5 23.51,36.51 24.46,36.51 24.47,36.52 24.47,36.63 | v21.01,29.36 22.07,28.3 v26.43,28.3 | v7.33,13.93 7.09,14.17 v6.91,19.52 6.64,19.57 6.12,19.05 6.66,19.05 7.06,19.46 | U$7.G 47.22,43.03 48.64,43.03 51.89,39.78 51.99,39.78
  Route15 0.381: v29.41,39.79 26.43,35.61 26.43,34.25 | v29.78,1.42 28,3.02 v28,11 | v58.36,36.34 58.36,37.87 57.16,39.07 57.16,40.84 v57,41.01 | v51.03,47.71 38.86,47.71 v37.8,48.2 36.69,45.54 v22.14,45.54 | v22.14,45.54 16.05,39.46 v9.07,39.46 9.07,38.77 6.13,35.59 v2.56,34.06 3.1,33.02 4.41,30.37 5.17,28.83 v8.74,26.49 | v22.14,45.54 22.16,45.52 22.16,41.29 23.5,39.95 v23.5,37.5 | v37.41,14.17 37.73,14.49 39.78,14.49
  Route15 0.762: v6.12,19.09 5.87,18.92 | 6.73,19.74 6.73,20.08 3.31,23.5 3.31,29.28 4.41,30.37
  Route15 1.524: v23.5,37.5 23.48,37.38 23.98,36.88
  Route15 2.794: 41.38,27.89 41.38,26.54 41.38,20.79 39.78,19.19 39.78,14.49 39.78,10.57 39.69,10.65 30.09,10.65 29.74,11 v28,11 | 41.38,27.89 47.49,34 49.92,36.18 49.92,37.71 51.99,39.78 52.38,40.16 57.16,40.16 INDMID.PPAD 57.5,40.52 v57,41.01 | 41.38,27.89 40.7,28.56 37.02,28.26 36.75,27.99 34.23,28.02 33.57,27.36 29.81,27.36 28.87,28.3 v26.43,28.3 26.43,34.25 26.43,34.43 23.98,36.88
  Route15 3.81: v44.97,34.48 47.49,34.45 47.49,34
  Bottom 0.254: v22.68,10.05 24.37,10.2 R5.1 | 32.31,15.57 36.02,15.57 v37.41,14.17 | v38.46,26.29 36.72,26.29 R16.2 32.35,21.92
  Bottom 1.016: U$9.2 U$9.TAB 5.72,7.57 6.71,8.56 6.66,13.26 v7.33,13.93
  Bottom 1.27: v28,11 28.4,9.58 28.88,9.09 | U$10.G 34.75,41.02 36.7,39.06 40.54,39.06 44.15,35.46
  Bottom 1.524: R9.1 R8.1 25.4,29.32 v26.43,28.3 | R7.1 58.23,39.07 | 58.23,39.07 R6.1 | R5.1 25.48,9.09 28.88,9.09 R4.1 31.57,9.12 | v57,41.01 56.97,40.32 58.23,39.07
  Bottom 3.81: U$2.1 40.49,38.54 40.49,38.51 v44.97,34.48
  other vias: 46.32,34.47 45.31,33.27 45.59,35.79 44.03,35.48 57,39.99 58,39.99 58,41.01 29.01,9.99 29.01,11 28,9.99 24.5,37.5 24.5,36.5 25.76,29.18 25.81,32.28 6.65,11.33 6.65,8.99 62.15,44.22 26.24,30.84 3.66,23.52 39.47,2.95
  pour Route15 (isolate 0.508): 1.21,45.16 3.16,3.92 5.75,1.02 44.23,0.95 43.66,4.43 42.09,9.74 42.21,14.67 43.35,22.07 45.94,26.06 48.91,28.21 53.01,29.35 59.59,31.37 63.18,32.38 64.45,58.76 50.67,59.4 50.36,54.14 19.84,52.57 19.9,46.05
  pour Bottom (isolate 1.016, rank 3): 33.43,45.03 33.43,42.62 34.11,41.94 34.11,37.64 35.23,36.53 39.73,36.53 42.77,33.48 42.77,33.45 44.5,31.72 45.42,31.72 46.38,32.69 47.22,33.53 47.22,35.56 46.76,36.02 46.76,42.57 44.04,45.29 35.33,45.29
IDX1
  Top 0.254: 60.38,41.8 INDMID.16
  Top 0.635: 60.38,41.8 60.68,42.57 60.63,44.12 59.44,44.7 59.44,45.97 58,47.37 INDEX.1
IDX2
  Top 0.254: INDMID.2
  Top 0.381: INDMID.2 57.84,43.61 58.09,44.45
  Top 0.635: 58.09,44.45 58.09,44.96 57.28,45.72 56.8,46.1 INDEX.2
IDXENC1  (via drill 0.38)
  Top 0.254: INDEX.5 v53.12,46.23 | HAND_MICRO.58 26.61,19.75 v27.33,20.47
  Route2 0.254: v27.33,20.47 38.66,20.47 51.1,32.92 51.1,42.04 53.77,44.7 53.77,45.58 v53.12,46.23
IDXENC2  (via drill 0.38)
  Top 0.254: INDEX.4 54.4,46.86 v54.41,46.18 | HAND_MICRO.57 22.68,19.25 v21.89,18.47
  Route2 0.254: v21.89,18.47 22.66,19.23 27.25,19.23 28.02,19.99 38.91,19.99 51.56,32.64 51.56,41.73 54.23,44.4 v54.41,46.18
IDXISEN  (via drill 0.38)
  Top 0.381: INDMID.1 58.7,43.36
  Top 0.635: 58.7,43.36 v59.36,43.26
  Bottom 0.635: v59.36,43.26 60.55,42.06 R6.2
IDXPWM1  (via drill 0.38)
  Top 0.254: INDMID.14 61.27,40.17 62.38,39.06 62.06,36.42 v61.49,35.8 | HAND_MICRO.61 25.59,21.25 31.42,27.08 45.11,27.08 52.25,34.21 52.25,36.14 v52.48,36.14
  Route2 0.254: 61.65,35.94 v61.49,35.8 60.07,34.37 53.95,34.37 v52.48,36.14
IDXPWM2  (via drill 0.38)
  Top 0.254: INDMID.13 59.77,38.55 v61.21,37.11 | HAND_MICRO.62 24.29,21.74 25.35,21.74 31.17,27.56 44.91,27.56 51.77,34.42 51.77,36.6 v52.35,37.19
  Route2 0.254: v52.35,37.19 61.16,37.16 v61.21,37.11
LED0
  Top 0.254: HAND_MICRO.53 25.63,17.25 27.56,19.18 27.91,19.18 28.52,19.79 28.52,20.07 29.18,20.72 RED.1
LED1
  Top 0.254: GREEN.1 28.73,22.5 28.73,22.15 28.32,21.74 28.32,21.03 28.07,20.78 28.07,20.09 27.61,19.63 27.23,19.63 25.34,17.75 HAND_MICRO.54
LED2
  Top 0.254: HAND_MICRO.52 25.89,16.75 27.86,18.72 28.96,18.72 29.87,19.63 32.41,19.63 33.93,22.33 33.93,23.26 YELLOW.1
MID1
  Top 0.381: INDMID.5 55.17,41.65
  Top 0.635: 55.17,41.65 53.95,41.83 53.29,42.75 51.64,43.71 49.55,45.8 44.02,45.8 MIDDLE.2
MID2
  Top 0.254: INDMID.3 57.15,42.77
  Top 0.381: 57.15,42.77 57.15,44.2
  Top 0.635: 57.15,44.2 56.79,44.4 55.93,44.88 52.17,44.88 50.19,46.86 MIDDLE.1
MIDENC1  (via drill 0.38, 0.39)
  Top 0.254: v40.26,45.21 40.32,45.43 MIDDLE.5 | v27.84,22.4 27.48,22.4 25.83,20.75 HAND_MICRO.60
  Route2 0.254: v40.26,45.21 41.5,43.97 47.95,43.97 50.19,41.73 50.19,33.48 38.15,21.44 28.8,21.44 v27.84,22.4
MIDENC2  (via drill 0.38, 0.39)
  Top 0.254: MIDDLE.4 41.35,46.5 v41.35,45.36 | v27.58,21.44 27.25,21.44 26.07,20.25 HAND_MICRO.59
  Route2 0.254: v41.35,45.36 42.29,44.42 48.26,44.42 50.65,42.04 50.65,33.2 38.41,20.95 28.07,20.95 v27.58,21.44
MIDISEN  (via drill 0.38)
  Top 0.381: INDMID.4 56.32,43.26
  Top 0.635: 56.32,43.26 v55.42,43.48
  Bottom 0.635: v55.42,43.48 54.46,42.52 R7.2
MIDPWM1
  Top 0.254: 55.17,40.23 INDMID.7 53.53,40.17 50.8,37.44 50.8,34.82 44.5,28.52 30.66,28.52 24.88,22.75 HAND_MICRO.64
MIDPWM2
  Top 0.254: HAND_MICRO.63 | HAND_MICRO.63 25.12,22.25 30.91,28.04 44.7,28.04 51.28,34.62 51.28,37.21 53.6,39.52 INDMID.8
N$1  (via drill 0.38)
  Top 0.254: v31.11,22.23 32.48,22.23 RED.2
  Bottom 0.254: R14.1 30.65,21.76 v31.11,22.23
N$2  (via drill 0.38)
  Top 0.254: GREEN.2 30.6,24.45 v31.62,25.4
  Bottom 0.254: v31.62,25.4 31.43,25.43 R15.1
N$3  (via drill 0.38)
  Top 0.254: v34.27,25.5 33.04,24.6 YELLOW.2
  Bottom 0.254: R16.1 34.04,25.31 v34.27,25.5
N$4
  Top 0.254: INDMID.6 50.5,40.83 IMF.P$1
N$5
  Top 0.254: PKYRNG.6 23.68,33.51 22.48,32.31 PYF.P$1
N$6
  Top 0.254: THMB.6 24.97,10.82 TF.P$1
N$7  (via drill 0.38)
  Top 0.254: v15.57,23.37 16.08,23.37 16.25,23.54 HAND_MICRO.13 16.25,26.79 v16.64,27.18 | R3.1 18.09,30.56 v15.95,30.56 15.91,30.56 C10.1
  Route2 0.254: v16.64,27.18 16.64,29.87 v15.95,30.56
  Bottom 0.254: v15.57,23.37 15.65,22.3 U$4.2
N$8  (via drill 0.38)
  Top 0.254: HAND_MICRO.24 11.66,19.25 v11.35,19.56 | v8.69,21.49 7.26,21.49 BOOTLOADER.9
  Route2 0.254: v11.35,19.56 10.62,19.56 v8.69,21.49
N$9
  Top 0.254: R3.2 C11.1 16.44,28.35 15.75,27.66 HAND_MICRO.14
N$10
  Top 0.254: HAND_MICRO.22 BOOTLOADER.8
N$11
  Top 0.254: BOOTLOADER.7 9.99,19.75 10.99,18.75 HAND_MICRO.25
N$12
  Top 0.254: RST.P$1 6.75,24.77 BOOTLOADER.10
N$17  (via drill 0.38)
  Top 0.254: v8.61,17.23 v8.61,17.22 8.31,17.52 BOOTLOADER.4 | v15.24,14.66 15.25,14.65 HAND_MICRO.34 | v2.74,20.5 2.99,20.25 BOOTLOADER.13
  Route15 0.254: v15.24,14.66 12.57,17.22 v8.61,17.22
  Bottom 0.254: v2.74,20.5 2.74,19.66 5.18,17.22 v8.61,17.22
N$18  (via drill 0.38)
  Top 0.254: HAND_MICRO.15 15.25,26.18 | 15.25,26.18 15.25,28.1 C10.2 | C12.2 14.02,28.35 | 14.02,28.35 C10.2 | 14.02,28.35 14.02,31.67 U$3.2 14.96,31.98 v15.7,32 | HAND_MICRO.16 14.75,25.68 15.25,26.18 | C11.2 16.67,29.65 15.37,28.35 C10.2
N$21
  Top 0.381: INDMID.9 56.07,37.77 55.14,37.77 53.26,35.89 C1.1
N$22
  Top 0.381: C4.1 29.18,32.61 26.26,35.09 PKYRNG.9
N$23
  Top 0.381: C7.1 23.88,4.24 23.88,5.87 26.23,8.22 THMB.9
N$24
  Top 0.254: O16.3 12.04,10.29 | 14.63,13.26 14.7,13.25 HAND_MICRO.33
  Top 0.508: 12.04,10.29 13.18,10.29 14.63,11.7 14.63,13.26
N$25
  Top 0.381: THMB.12 29.48,6.14 29.97,5.64 29.97,4.38 C8.1
N$26
  Top 0.381: PKYRNG.12 26.98,37.97 28.17,39.62 28.45,39.84 29.01,40.69 30.48,40.69 C5.1
N$27
  Top 0.381: C2.1 59.65,37.05 INDMID.12
N$28
  Top 0.254: O16.1 10.52,12.42 | 13.11,15.09 HAND_MICRO.32
  Top 0.508: 10.52,12.42 10.52,13.03 12.6,15.09 13.11,15.09
N$34  (via drill 0.38)
  Top 0.254: HAND_MICRO.17 11.26,22.75 v11.23,22.78 | v13.21,26.67 12.88,26.67 12.12,27.43 12.12,29.16 12.61,29.65 C12.1
  Bottom 0.254: v11.23,22.78 11.23,24.69 v13.21,26.67
N$35  (via drill 0.38)
  Top 0.254: USB.4 4.7,34.44 5.87,34.47 6.45,33.88 v6.45,29.31 | v14.23,20.03 14.04,20.03 13.77,19.76 HAND_MICRO.23 | v10.36,18.21 9.83,19.13 9.71,19.25 BOOTLOADER.6
  Bottom 0.254: v6.45,29.31 6.45,26.19 12.63,20.03 v14.23,20.03 12.89,18.23 v10.36,18.21
OSC
  pour Route15 (isolate 0.406, rank 6): 9.41,9 12.62,9 12.62,9.75 13.53,9.75 15.14,11.37 15.14,13.64 13.49,15.29 11.9,15.29 9.69,13.08 9.41,13.08
  pour Bottom (isolate 0.406, rank 6): 9.41,9 12.62,9 12.62,9.75 13.53,9.75 15.14,11.37 15.14,13.64 13.49,15.29 11.9,15.29 9.69,13.08 9.41,13.08
  pour Route2 (isolate 0.406, rank 6): 9.41,9 12.62,9 12.62,9.75 13.53,9.75 15.14,11.37 15.14,13.64 13.49,15.29 11.9,15.29 9.69,13.08 9.41,13.08
PKY1
  Top 0.254: PKYRNG.5
  Top 0.381: PKYRNG.5 22.17,34.67
  Top 0.635: 22.17,34.67 19.94,33.78 16.31,37.49 14.99,38.71 PINKY.2
PKY2
  Top 0.381: 19.58,37.03 20.12,36.67 PKYRNG.3
  Top 0.635: 19.58,37.03 16.12,39.32 PINKY.1
PKYENC1  (via drill 0.38)
  Top 0.254: HAND_MICRO.26 13.47,18.25 13.87,18.47 13.95,19.13 v14.86,19.23 | PINKY.5 11.32,37.98 v11.35,37.95
  Route2 0.254: v11.35,37.95 11.35,24.11 14.96,20.5 14.96,19.33 v14.86,19.23
PKYENC2  (via drill 0.38, 0.39)
  Top 0.254: HAND_MICRO.27 13.63,17.75 13.64,17.75 13.92,17.75 14.63,18.41 15.24,18.41 v15.67,18.67 | v12.52,35.92 PINKY.4
  Route2 0.254: v15.67,18.67 15.75,20.8 12.27,24.28 12.27,31.9 13.69,33.33 13.69,34.75 v12.52,35.92
PKYISEN  (via drill 0.38)
  Top 0.254: HAND_MICRO.9 18.25,26.1 v18.82,26.67
  Top 0.381: PKYRNG.4 21.69,35.81
  Top 0.635: 21.69,35.81 v20.02,35.56
  Bottom 0.254: v18.82,26.67 20.02,27.86 v20.02,35.56
  Bottom 0.635: v20.02,35.56 22.07,33.96 R9.2
PKYPWM1
  Top 0.254: 24.31,34.71 PKYRNG.7 24.33,34.72 24.33,33.33 24.11,33.1 24.11,24.92 19.53,20.34 18.67,20.34 16.26,17.93 14.88,17.93 14.2,17.25 HAND_MICRO.28
PKYPWM2
  Top 0.254: 24.99,34.71 PKYRNG.8 24.98,33.03 24.61,32.66 24.61,24.66 19.84,19.89 18.95,19.89 16.46,17.4 15.09,17.4 14.44,16.75 HAND_MICRO.29
RNG1
  Top 0.254: PKYRNG.16
  Top 0.381: PKYRNG.16 23.01,40.69
  Top 0.635: 23.01,40.69 23.01,42.06 27.96,42.06 29.11,43.16 29.11,43.51 29.12,44.12 RING.1
RNG2
  Top 0.381: 20.02,38.1 20.57,37.33 PKYRNG.2
  Top 0.635: 20.02,38.1 19.13,39.67 21.51,43.16 27.38,43.16 27.89,43.89 27.89,45.11 27.92,45.11 RING.2
RNGENC1  (via drill 0.38)
  Top 0.254: HAND_MICRO.2 21.75,23.63 v21.01,23.27 | v23.77,44.5 24.33,45.44 RING.5
  Route2 0.254: v21.01,23.27 21.39,24.77 22.53,25.91 22.53,29.26 18.31,33.48 18.31,41.38 21.08,44.35 23.47,44.48 v23.77,44.5
RNGENC2  (via drill 0.38)
  Top 0.254: RING.4 25.47,44.93 v25.3,44.42 | v23.32,26.8 22.27,25.76 HAND_MICRO.1
  Route2 0.254: v25.3,44.42 24.66,43.74 21.49,43.51 19.18,40.92 19.18,33.93 23.62,29.49 23.62,27.1 v23.32,26.8
RNGISEN  (via drill 0.38)
  Top 0.254: HAND_MICRO.10 17.75,25.73 v17.25,26.24
  Top 0.381: PKYRNG.1 21.34,38.13
  Top 0.635: 21.34,38.13 v20.6,39.62
  Bottom 0.254: v17.25,26.24 18.8,27.79 18.8,37.21 20.6,39.01 v20.6,39.62
  Bottom 0.635: v20.6,39.62 21.01,40.03 R8.2
RNGPWM1  (via drill 0.38)
  Top 0.254: PKYRNG.14 24.32,40.43 24.61,40.72 v26.89,40.58 | HAND_MICRO.46 21.25,14.34 21.02,14.57 19.88,14.57 v19.65,14.8
  Route2 0.254: v19.65,14.8 19.65,20.77 24.47,25.59 24.47,33.71 26.89,36.12 v26.89,40.58
RNGPWM2  (via drill 0.38)
  Top 0.254: PKYRNG.13 26.68,39.27 v27.94,40.62 | HAND_MICRO.49 v23.24,14.45
  Route2 0.254: v27.94,40.62 27.94,39.59 27.47,39.12 27.47,35.99 24.91,33.43 24.91,25.44 20.05,20.59 20.05,16.55 21.44,14.48 v23.24,14.45
SCL0  (via drill 0.38, 0.39)
  Top 0.254: v17.07,14.68 16.75,14.52 HAND_MICRO.37 16.75,11.32 17.27,10.79 17.27,8.41 R10.1 15.15,9.21 v13.89,8.99 | U$1.14 43.79,39.91 44.98,38.71 46.71,38.71 U$7.C
  Route2 0.254: U$8.C 62.1,46.53 59.89,46.53 56.26,48.51 54.76,49.76 50.27,49.76 49.35,48.84 40.06,48.84 39.73,49.17 39.15,49.28 | 39.15,49.28 35.66,49.94 U$5.C 33.83,49.02 29.9,49.02 27.94,47.07 27.94,43.18 30.76,40.36 30.76,38.58 28.88,36.7 28.88,27.91 22.63,21.67 v22.73,21.26 | U$7.C 46.63,40.66 45.21,40.66 42.37,43.51 41.17,43.51 40.64,44.04 40.34,44.04 39.27,45.11 39.27,49.17 39.15,49.28 | v13.89,8.99 13.89,7.42 15.16,6.22 U$11.SCL
  Route15 0.254: v17.07,14.68 17.58,15.34 18.03,15.57 20.8,20.47 v22.73,21.26
SCL1  (via drill 0.38, 0.39)
  Top 0.254: HAND_MICRO.55 23.28,18.25 22.23,16.48 v22.28,16.13
  Route2 0.254: U$12.SCL 3.91,13.03 7.87,13.03 10.44,15.52 16,15.52 v16.23,15.29
  Bottom 0.254: R12.1 19.85,16.61 | 19.85,16.61 v22.28,16.13 | v16.23,15.29 16.64,15.7 16.82,15.7 17.96,16.03 19.85,16.61
SDA0  (via drill 0.38, 0.39)
  Top 0.254: HAND_MICRO.38 17.25,11.83 17.86,11.23 | 17.86,11.23 17.86,8.9 R11.1 | U$1.15 44.84,40.56 U$7.D | v35.99,48.77 35.76,49 33.78,49 U$5.D | v18.01,11.84 17.86,11.68 17.86,11.23
  Route2 0.254: U$8.D 59.61,48.49 49.96,53.11 45.8,53.03 40.37,51.86 35.94,50.9 33.81,50.9 U$5.D 29.49,49.94 27.48,47.93 27.48,42.88 30.3,40.06 30.3,38.86 28.42,36.98 28.42,28.19 21.51,21.29 v21.72,19.58 | U$7.D 45.47,39.65 42.06,43.05 40.56,43.05 38.76,44.86 38.76,46 v35.99,48.77 | U$11.SDA 16.03,4.17 16.03,6.96 14.94,8.05 v14.94,8.41
  Route15 0.254: v21.72,19.58 20.07,17.63 19.76,16 18.01,14.25 v18.01,11.84
  Bottom 0.254: v14.94,8.41 15.57,9.14 17.86,9.14 18.01,9.3 v18.01,11.84
SDA1  (via drill 0.38, 0.39)
  Top 0.254: HAND_MICRO.56 22.99,18.75 22.28,17.56 22,17.2 v21.16,17.32 17.6,17.32 v17.09,16.82
  Route2 0.254: U$12.SDA 3.58,16.15 6.27,16.15 7.34,15.09 8.76,15.09 10.36,16.69 15.42,17.12 v17.09,16.82
  Bottom 0.254: v21.16,17.32 21.08,17.75 20.98,18.62 20.37,18.92 R13.1
THA1
  Top 0.381: 32.46,11.51 32.16,11.47 THMB.16
  Top 0.635: 32.46,11.51 32.99,11.12 33.45,10.29 33.45,7.54 33.98,7.01 THUMB_A.1
THA2
  Top 0.381: 29.34,14.4 28.8,13.95 28.82,13.92 THMB.2
  Top 0.635: 29.34,14.4 32.33,15.47 33.53,12.27 34.52,10.59 34.52,8.46 34.75,8.2 THUMB_A.2
THAENC1  (via drill 0.38)
  Top 0.254: THUMB_A.5 36.54,11.67 35.89,12.52 35.89,13.69 v35.46,14.12 | HAND_MICRO.35 15.75,11.63 15.32,11.2 v15.32,10.21
  Route2 0.254: v35.46,14.12 35.56,14.12 36.02,13.66 36.02,9.14 32.31,5.49 20.34,5.49 v15.32,10.21
THAENC2  (via drill 0.38)
  Top 0.254: THUMB_A.4 35.88,10.6 35.71,10.77 35.71,11.58 v35.03,13.18 | HAND_MICRO.36 16.25,10.62 v16.43,10.44
  Route2 0.254: v35.03,13.18 35.03,9.14 31.85,6.04 20.95,6.04 v16.43,10.44
THAISEN  (via drill 0.38)
  Top 0.254: HAND_MICRO.11 17.25,23.01 v17.63,22.63
  Top 0.381: THMB.1 29.65,13.39
  Top 0.635: 29.65,13.39 v31.57,13.82
  Route2 0.254: v17.63,22.63 17.63,21.39 18.82,20.65 18.87,15.9 18.9,14.36 19.72,13.39 25.04,13.39 25.96,14.3 31.09,14.3 v31.57,13.82
  Bottom 0.635: v31.57,13.82 31.55,13.79 R4.2
THAPWM1  (via drill 0.38)
  Top 0.254: THMB.14 30.82,10.13 31.85,10.13 32.23,9.75 32.23,9.27 31.75,8.79 v31.75,7.38 | v18.75,10.13 v18.75,10.14 HAND_MICRO.41
  Route2 0.254: v31.75,7.38 30.91,6.58 23.44,6.58 19.89,10.13 v18.75,10.13
THAPWM2  (via drill 0.38)
  Top 0.254: THMB.13 30.56,9.31 v30.56,7.47 | v19.51,11.28 19.25,11.54 HAND_MICRO.42
  Route2 0.254: v30.56,7.47 29.26,7.16 23.7,7.16 v19.51,11.28
THB1
  Top 0.254: 25.83,11.63 25.98,11.47 THMB.5
  Top 0.635: 25.83,11.63 25.22,12.57 25.83,14.28 27.3,15.01 27.81,15.85 28.42,16.54 31.6,17.53 33.98,18.06 35.36,18.06 35.89,18.52 36.12,20.27 36.96,20.73 37.42,20.65 THUMB_B.2
THB2
  Top 0.381: 28.8,15.39 28.19,14.38 28.18,14.36 THMB.3
  Top 0.635: 28.8,15.39 31.85,16.46 34.59,16.99 36.27,16.99 37.21,17.98 THUMB_B.1
THBENC1
  Top 0.254: HAND_MICRO.51 26.43,16.25 27.79,17.86 33.2,19.23 34.92,22.76 36.78,23.37 37.08,24.28 37.94,24.28 THUMB_B.5
THBENC2
  Top 0.254: HAND_MICRO.50 26.77,15.72 28.02,17.35 33.6,18.75 35.31,22.25 THUMB_B.4
THBISEN  (via drill 0.38)
  Top 0.254: v16.38,22.61 16.75,22.97 HAND_MICRO.12
  Top 0.381: THMB.4 27.3,13.28
  Top 0.635: 27.3,13.28 v26.72,13.46
  Route2 0.254: v26.72,13.46 25.93,12.68 19.18,12.68 18.11,14.2 18.11,20.22 16.38,21.49 v16.38,22.61
  Bottom 0.635: v26.72,13.46 25.45,12.19 R5.2
THBPWM1
  Top 0.254: THMB.7 25.24,10.18 24.99,9.93 24.99,9.42 24.59,9.02 22.43,9.02 20.75,10.7 HAND_MICRO.45
THBPWM2
  Top 0.254: THMB.8 25.26,8.56 22.12,8.56 20.25,10.43 HAND_MICRO.44
USB_D1_N
  Top 0.333: R1.1 10.42,32.92 9.78,32.79 9.78,33.53 9.78,34.47 9.36,34.89 D-.P$1 7.98,35.23 7.55,35.23 7.14,35.64 5.69,35.64 5.56,35.77 USB.2
USB_D1_P
  Top 0.333: R2.1 9.27,31.43 9.27,33.53 8.87,33.93 D+.P$1 7.9,34.71 7.7,34.72 7.34,34.72 6.93,35.13 5.69,35.13 5.68,35.12 USB.3
USB_D2_N
  Top 0.254: 19.73,23.82 19.75,23.82 HAND_MICRO.6
  Top 0.333: R1.2 9.86,30.08 9.86,27.97 16.06,21.77 19.05,21.77 19.73,22.46 19.73,23.82
USB_D2_P
  Top 0.254: 20.25,23.83 HAND_MICRO.5
  Top 0.333: R2.2 8.8,28.96 9.35,28.96 9.35,27.76 15.85,21.26 19.26,21.26 20.25,22.25 20.25,23.82 20.25,23.83
VIN
  Bottom 0.254: 28.63,34.27 30.57,36.21 U$2.2
  Bottom 1.016: 32.77,40.16 33.3,39.62 33.3,38.63 | 31.34,41.05 30.66,40.36 30.66,38.68 31.62,39.65 31.62,40.72
  Bottom 1.27: U$10.B 32.21,37.9 U$2.2
  Bottom 1.905: 28.63,30.84 28.63,28.74 29.74,27.62 29.65,27.62 26.76,24.73
  Bottom 2.032: 28.63,34.27 28.63,30.84
  pour Bottom (isolate 0.762): 33.68,38.35 33.68,41.76 33.07,42.37 33.07,44.96 32.61,45.42 31.29,45.42 29.87,43.99 28.45,43.99 27.61,43.15 27.43,42.98 27.43,37.44 27.43,32.28 27.61,32.11 27.61,28.88 25.48,26.75 25.48,24.84 26.64,23.67 28.14,23.67 30.25,25.78 30.25,30 30.25,32.61 30.68,33.05 33.12,33.05 33.68,33.6 33.68,37.34